# EAGLE design DosTres_v3 (EAGLE 6.2)
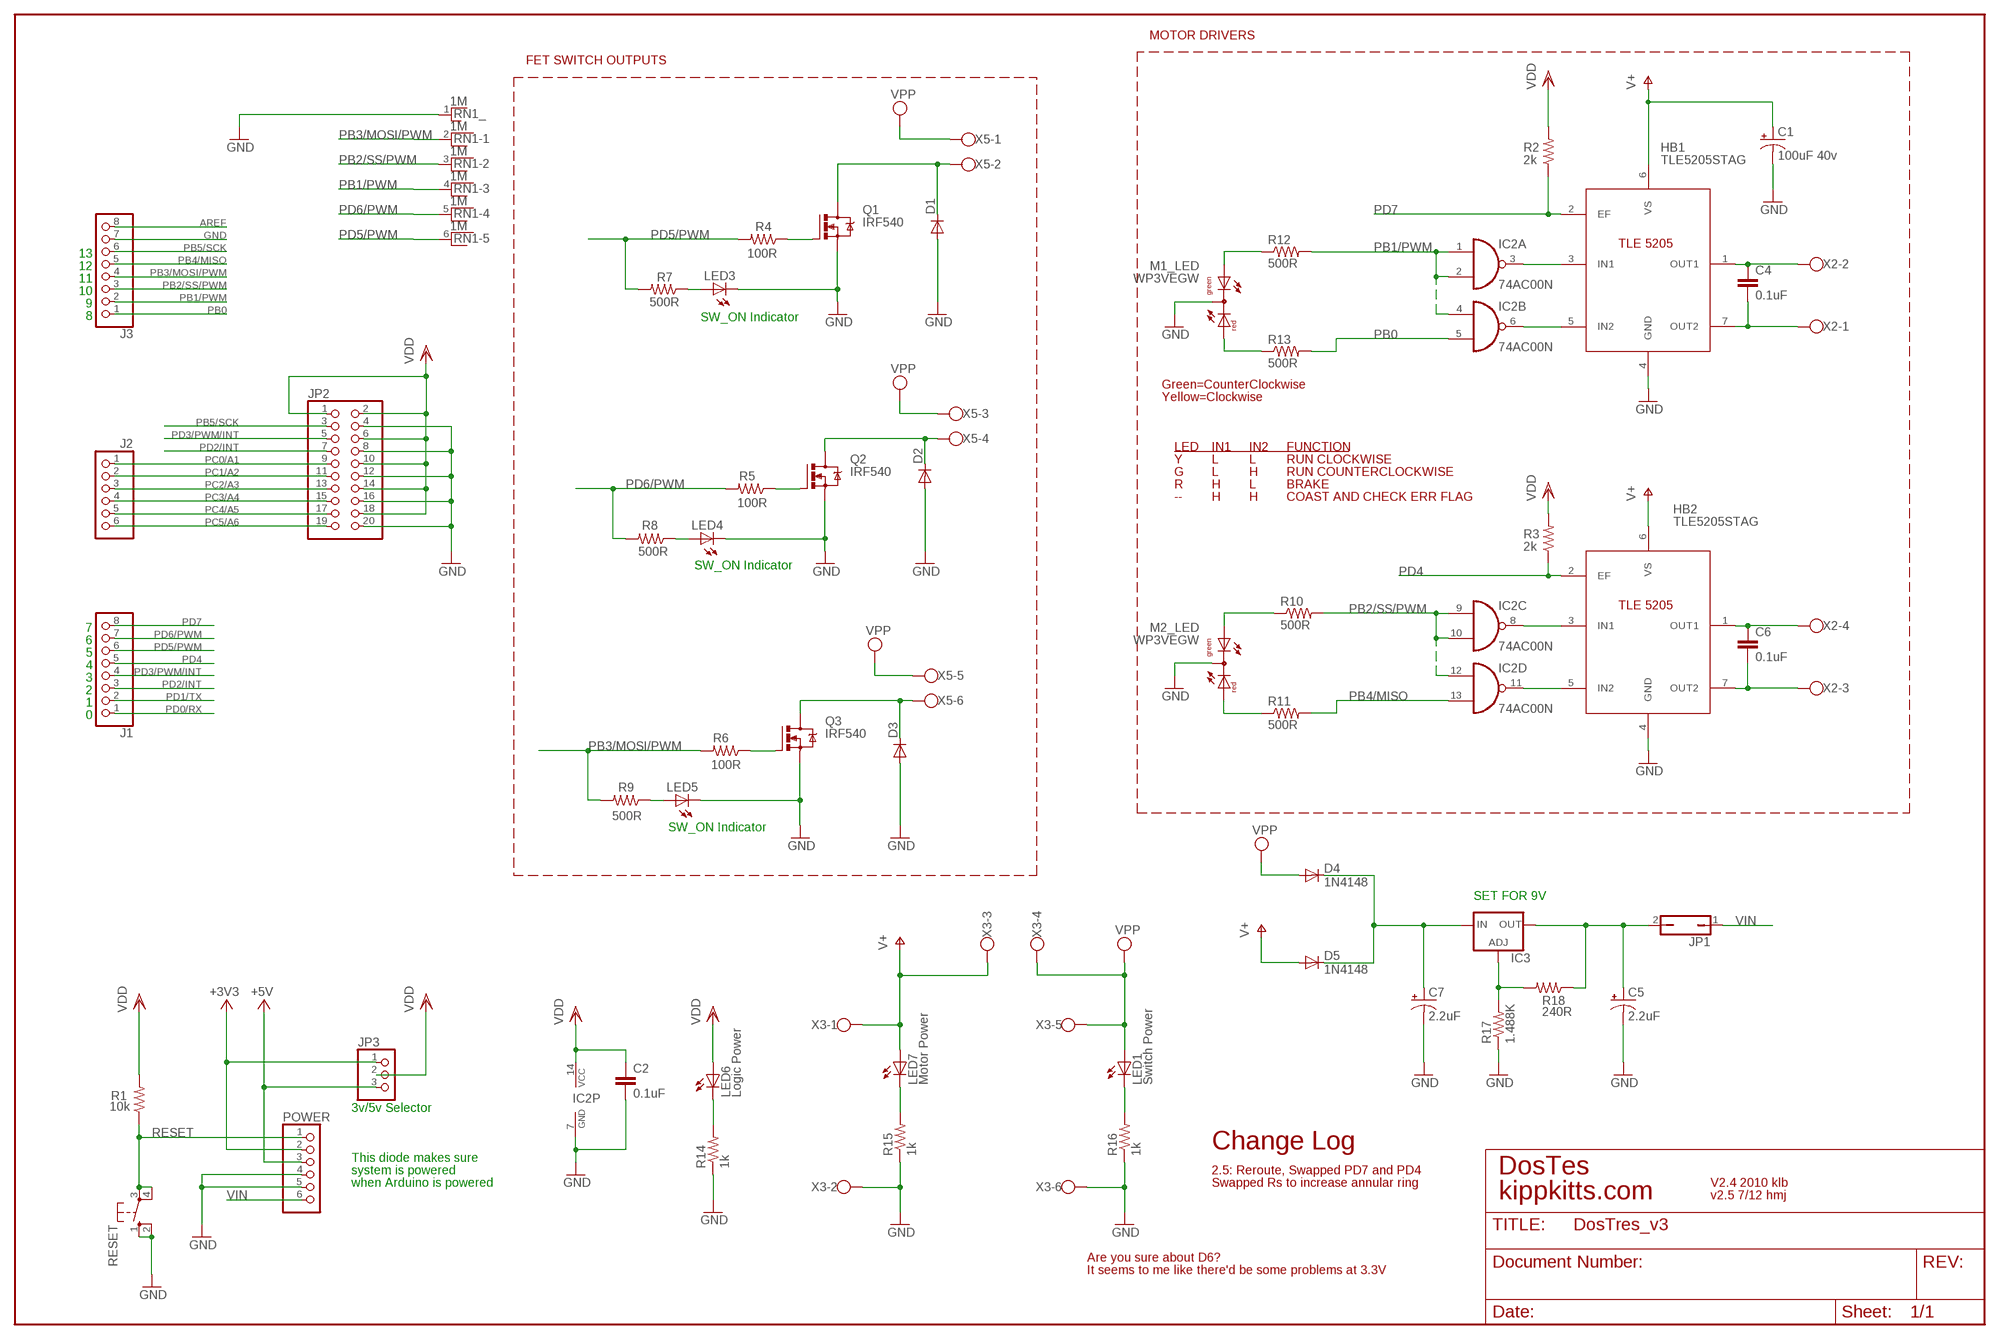
[diagram p0: schematic, sheet 1]

## Parts
C1  100uF 40v  CPOL-USE2,5-6E  [E2,5-6E]
C2  0.1uF  CAPKIT  [CAP-PTH-SMALL-KIT]
C4  0.1uF  CAPKIT  [CAP-PTH-SMALL-KIT]
C5  2.2uF  CAP_POLPTH2  [CPOL-RADIAL-10UF-25V]
C6  0.1uF  CAPKIT  [CAP-PTH-SMALL-KIT]
C7  2.2uF  CAP_POLPTH2  [CPOL-RADIAL-10UF-25V]
D1  DIODE-1MMHOLED-7.5BH  [D-7.5BH]
D2  DIODE-1MMHOLED-7.5BH  [D-7.5BH]
D3  DIODE-1MMHOLED-7.5BH  [D-7.5BH]
D4  1N4148  DIODE-1MMHOLED-7.5BH  [D-7.5BH]
D5  1N4148  DIODE-1MMHOLED-7.5BH  [D-7.5BH]
HB1  TLE5205STAG  [TO220-7-11]
HB2  TLE5205STAG  [TO220-7-11]
IC2  74AC00N  [DIL14]
IC3  LM317TS  [317TS]
J1  PINHD-1X8  [1X08]
J2  PINHD-1X6  [1X06]
J3  PINHD-1X8  [1X08]
JP1  JP1Q  [JP1]
JP2  PINHD-2X10HAND  [2X10HAND]
JP3  PINHD-1X3  [1X03]
LED1  Switch Power  LED3MMX1MM3MM  [LED3MM]
LED3  LED3MMX1MM3MM  [LED3MM]
LED4  LED3MMX1MM3MM  [LED3MM]
LED5  LED3MMX1MM3MM  [LED3MM]
LED6  Logic Power  LED3MMX1MM3MM  [LED3MM]
LED7  Motor Power  LED3MMX1MM3MM  [LED3MM]
M1_LED  WP3VEGW  [DUOLED-A-3MM]
M2_LED  WP3VEGW  [DUOLED-A-3MM]
POWER  PINHD-1X6  [1X06]
Q1  IRF540  [TO220BV]
Q2  IRF540  [TO220BV]
Q3  IRF540  [TO220BV]
R1  10k  R-US_0207/2V  [0207/2V]
R2  2k  R-US_0207/2V  [0207/2V]
R3  2k  R-US_0207/2V  [0207/2V]
R4  100R  R-US_0207/2V  [0207/2V]
R5  100R  R-US_0207/2V  [0207/2V]
R6  100R  R-US_0207/2V  [0207/2V]
R7  500R  R-US_0207/2V  [0207/2V]
R8  500R  R-US_0207/2V  [0207/2V]
R9  500R  R-US_0207/2V  [0207/2V]
R10  500R  R-US_0207/2V  [0207/2V]
R11  500R  R-US_0207/2V  [0207/2V]
R12  500R  R-US_0207/2V  [0207/2V]
R13  500R  R-US_0207/2V  [0207/2V]
R14  1k  R-US_0207/2V  [0207/2V]
R15  1k  R-US_0207/2V  [0207/2V]
R16  1k  R-US_0207/2V  [0207/2V]
R17  1.488K  R-US_0207/2V  [0207/2V]
R18  240R  R-US_0207/2V  [0207/2V]
RESET  10-XX  [B3F-10XX]
RN1  1M  RNX5  [RN-6]
X2  W237-4  [W237-4]
X3  W237-6  [W237-6]
X5  W237-6  [W237-6]

## Nets
+3V3: JP3.1 POWER.2
+5V [usbvcc]: JP3.3 POWER.3
AREF [aref]: J3.8
GND [gnd]: C1.- C2.2 C5.2(-) C7.2(-) D1.A D2.A D3.A HB1.4(GND) HB2.4(GND) IC2.7(P:GND) J3.7 JP2.4 JP2.8 JP2.12 JP2.16 JP2.20 LED3.K(C) LED4.K(C) LED5.K(C) M1_LED.2(C) M2_LED.2(C) POWER.4 POWER.5 Q1.S Q2.S Q3.S R14.1 R15.1 R16.1 R17.1 RESET.1(S) RESET.2(S1) RN1.1 X3.2 X3.6
M1.1: C4.1 HB1.1(OUT1) X2.2
M1.2: C4.2 HB1.7(OUT2) X2.1
M2.1: C6.1 HB2.1(OUT1) X2.4
M2.2: C6.2 HB2.7(OUT2) X2.3
N$1: Q1.G R4.1
N$2: Q2.G R5.1
N$3: Q3.G R6.1
N$4: M1_LED.3(AG) R12.1
N$5: HB1.3(IN1) IC2.3(A:O)
N$6: HB1.5(IN2) IC2.6(B:O)
N$7: HB2.3(IN1) IC2.8(C:O)
N$8: HB2.5(IN2) IC2.11(D:O)
N$9: M1_LED.1(AR) R13.1
N$10 [power]: D3.C Q3.D X5.6
N$11 [power]: D2.C Q2.D X5.4
N$12: M2_LED.1(AR) R11.1
N$13: M2_LED.3(AG) R10.1
N$14 [power]: D1.C Q1.D X5.2
N$15: C7.1(+) D4.C D5.C IC3.3(IN)
N$16: LED3.A R7.1
N$17: LED4.A R8.1
N$18: LED5.A R9.1
N$19: C5.1(+) IC3.2(OUT) JP1.2 R18.1
N$20: IC3.1(ADJ) R17.2 R18.2
N$22: LED6.K(C) R14.2
N$23: LED7.K(C) R15.2
N$24: LED1.K(C) R16.2
PB0: IC2.5(B:I1) J3.1 R13.2
PB1/PWM: IC2.1(A:I0) IC2.2(A:I1) IC2.4(B:I0) J3.2 R12.2 RN1.4
PB2/SS/PWM: IC2.9(C:I0) IC2.10(C:I1) IC2.12(D:I0) J3.3 R10.2 RN1.3
PB3/MOSI/PWM: J3.4 R6.2 R9.2 RN1.2
PB4/MISO: IC2.13(D:I1) J3.5 R11.2
PB5/SCK: J3.6 JP2.3
PC0/A1: J2.1 JP2.9
PC1/A2: J2.2 JP2.11
PC2/A3: J2.3 JP2.13
PC3/A4: J2.4 JP2.15
PC4/A5: J2.5 JP2.17
PC5/A6: J2.6 JP2.19
PD0/RX: J1.1
PD1/TX: J1.2
PD2/INT: J1.3 JP2.7
PD3/PWM/INT: J1.4 JP2.5
PD4: HB2.2(EF) J1.5 R3.1
PD5/PWM: J1.6 R4.2 R7.2 RN1.6
PD6/PWM: J1.7 R5.2 R8.2 RN1.5
PD7: HB1.2(EF) J1.8 R2.1
RESET: POWER.1 R1.1 RESET.3(P) RESET.4(P1)
V+ [power]: C1.+ D5.A HB1.6(VS) HB2.6(VS) LED7.A X3.1 X3.3
VDD [usbvcc]: C2.1 IC2.14(P:VCC) JP2.1 JP2.2 JP2.6 JP2.10 JP2.14 JP2.18 JP3.2 LED6.A R1.2 R2.2 R3.2
VIN [power]: JP1.1 POWER.6
VPP [power]: D4.A LED1.A X3.4 X3.5 X5.1 X5.3 X5.5

## Notes on the sheet
- MOTOR DRIVERS
- FET SWITCH OUTPUTS
- 13
- 12
- 11
- 10
- 9
- 8 | SW_ON Indicator
- Green=CounterClockwise
- Yellow=Clockwise
- LED | IN1 | IN2 | FUNCTION
- Y | L | L | RUN CLOCKWISE
- G | L | H | RUN COUNTERCLOCKWISE
- R | H | L | BRAKE
- -- | H | H | COAST AND CHECK ERR FLAG
- SW_ON Indicator
- 7
- 6
- 5
- 4
- 3
- 2
- 1
- 0
- SW_ON Indicator
- SET FOR 9V
- 3v/5v Selector
- Change Log
- This diode makes sure
- system is powered | 2.5: Reroute, Swapped PD7 and PD4 | DosTes
- when Arduino is powered | Swapped Rs to increase annular ring | V2.4 2010 klb
- kippkitts.com | v2.5 7/12 hmj
- Are you sure about D6?
- It seems to me like there'd be some problems at 3.3V

## Library data of the parts
C1 = resistor:CPOL-US: POLARIZED CAPACITOR, American symbol
C2 C4 C6 = SparkFun:CAP: Capacitor Standard 0603 ceramic capacitor, and 0.1" leaded capacitor.
C5 C7 = KippKitts:CAP_POL: Capacitor Polarized These are standard SMD and PTH capacitors. Normally 10uF, 47uF, and 100uF in electrolytic and tantalum varieties. Always verify the external diameter of the through hole cap, it varies with capacity, voltage, and manufacturer. The EIA devices should be standard.
D1-D5 = KippKits:DIODE-1MMHOLE: DIODE
HB1 HB2 = infineon_tle_power:TLE5205
IC2 = 74xx-eu:74*00: Quad 2-input NAND gate
IC3 = v-reg:LM317TS: VOLTAGE REGULATOR
J1 J3 = pinhead:PINHD-1X8: PIN HEADER
J2 POWER = pinhead:PINHD-1X6: PIN HEADER
JP1 = jumper:JP1Q: JUMPER
JP2 = KippKits:PINHD-2X10: PIN HEADER
JP3 = pinhead:PINHD-1X3: PIN HEADER
LED1 LED3-LED7 = KippKits:LED3MMX1MM: LED with 1mm holes;
M1_LED M2_LED = KippKits:WP3VEGW
Q1-Q3 = transistor-power:IRF540: HEXFET Power MOSFET
R1-R18 = adafruit:R-US_: RESISTOR, American symbol
RESET = switch-omron:10-XX: OMRON SWITCH; MPN: B3F-1000; OC_FARNELL: 176432; OC_NEWARK: 36M3542
RN1 = resistor-net:RNX5: RESISTOR NETWORK; OC_FARNELL: unknown; OC_NEWARK: unknown
X2 = con-wago-500:W237-4: WAGO SCREW CLAMP; OC_FARNELL: unknown; OC_NEWARK: unknown
X3 X5 = con-wago-500:W237-6: WAGO SCREW CLAMP; OC_FARNELL: unknown; OC_NEWARK: unknown

## Net classes
0 default: width 0.152 mm, drill 0.305 mm, clearance 0.152 mm
1 power: width 0.203 mm, drill 0.305 mm, clearance 0.203 mm
2 gnd: width 0.203 mm, drill 0.305 mm, clearance 0.152 mm
3 usbvcc: width 0.203 mm, drill 0.305 mm, clearance 0.152 mm
4 aref: width 0.203 mm

## Board
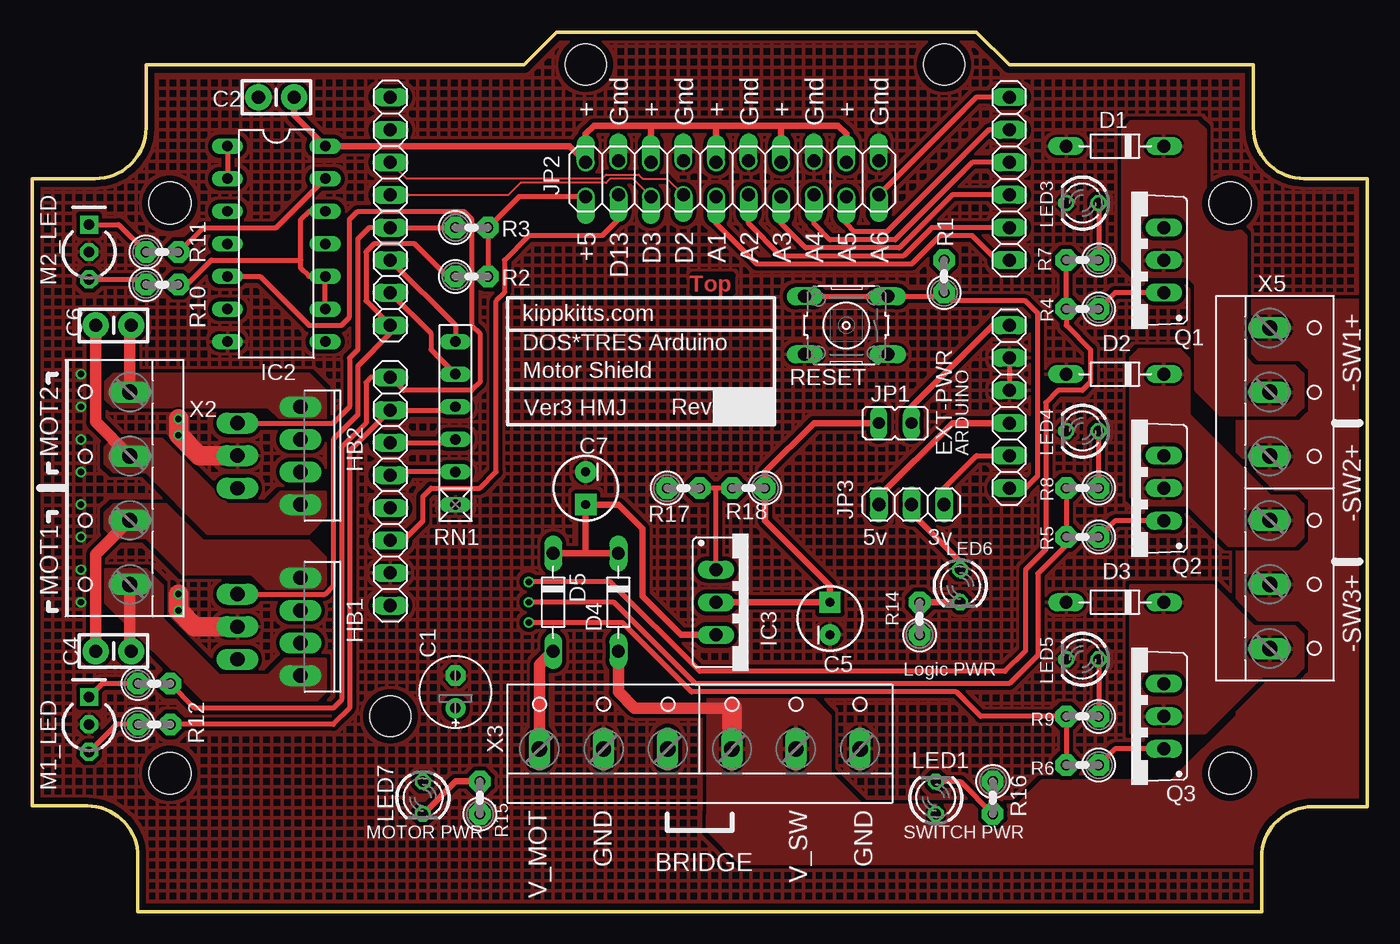
[diagram p1: board, top side]
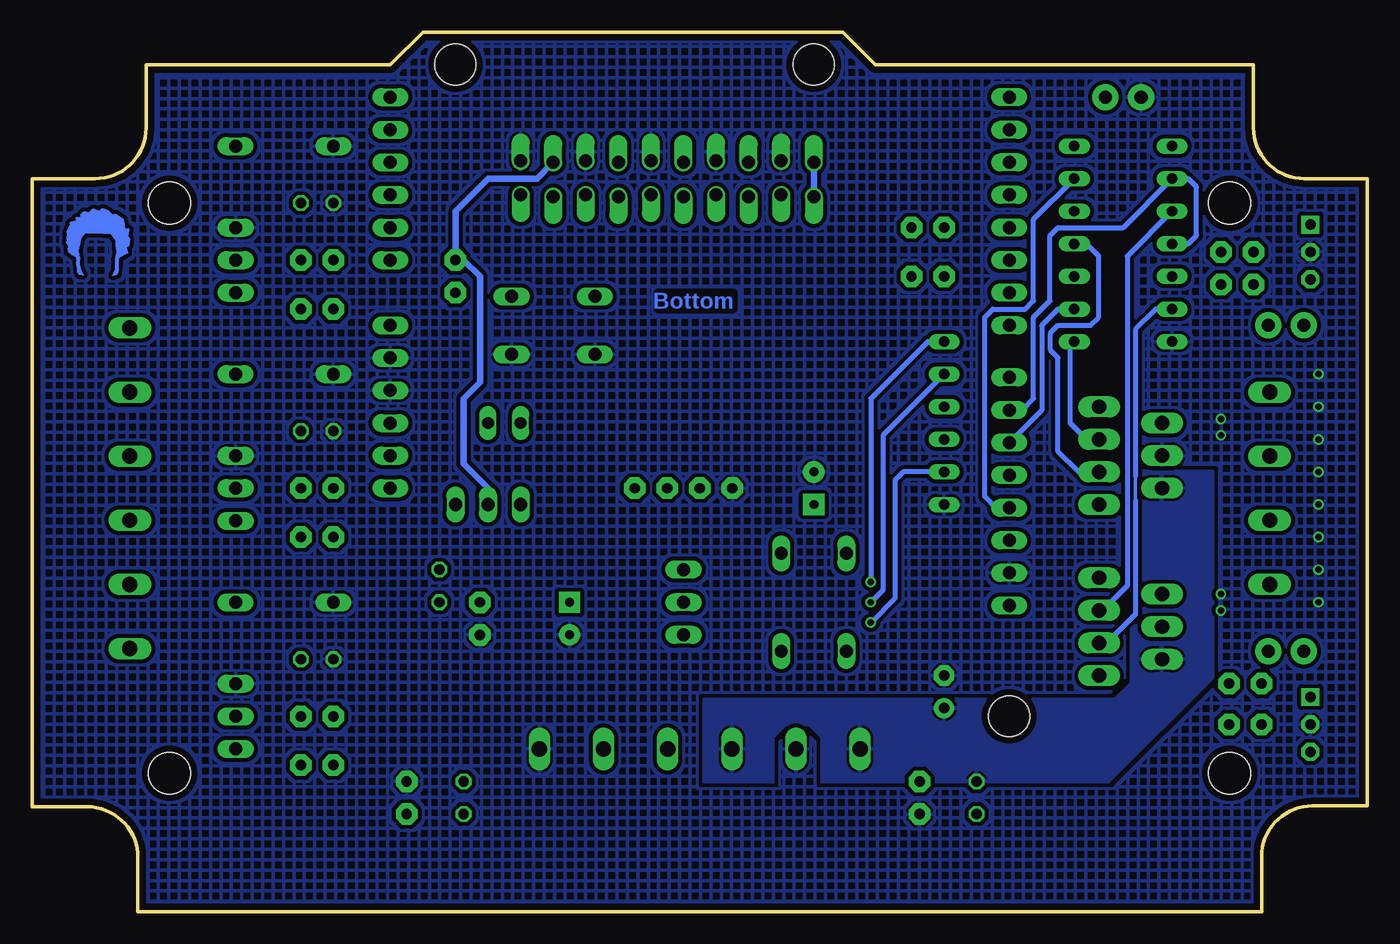
[diagram p2: board, bottom side, seen from below]

Size 104.14 x 68.58 mm. Coordinates in mm from the lower left corner, seen from the top.
Outline: 38.35,66.04 40.89,68.58 73.66,68.58 76.2,66.04 95.25,66.04 95.25,61.11 arc90 99.21,57.15 104.14,57.15 104.14,8.19 99.85,8.19 arc90 95.89,4.22 95.89,0 8.26,0 8.26,4.29 arc90 4.29,8.26 0,8.26 0,57.15 4.93,57.15 arc90 8.89,61.11 8.89,66.04 38.35,66.04
Copper layers (1*16): Top 0.035mm / dielectric 1.5mm / Bottom 0.035mm
Design rules: minimum track width 6mil, minimum drill 12mil, track to track 6mil, track to pad 6mil, pad to pad 6mil, via to via 6mil, smd to smd 6mil, copper to edge 20mil, drill to drill 8mil, minimum pad ring 8mil, minimum via ring 6mil, stop-mask expansion 3mil, vias tented up to drill 0mil, thermal gap 8mil
Holes 3.2 mm at 43.18,66.04 71.12,66.04 27.94,15.24
Holes 3.28 mm at 10.74,10.79 10.74,55.24 93.42,55.24 93.42,10.79

### Footprints (pad centres in the part's own frame; a part is rotated, then mirrored left to right if it is on the bottom)
E2,5-6E = drill 0.813 pad 1.575: + -1.27,0 | drill 0.813 pad 1.575 octagon: - 1.27,0
CAP-PTH-SMALL-KIT = drill 1.016 pad 2.032: 1 -1.397,0; 2 1.397,0
CPOL-RADIAL-10UF-25V = drill 0.7 pad 1.651 square: 1 1.27,0 | drill 0.7 pad 1.651: 2 -1.27,0
D-7.5BH = drill 1 long: A 3.81,0; C -3.81,0
TO220-7-11 = drill 1.118 pad 1.626 long: 1 -3.81,-3.126; 2 -2.54,-8.036; 3 -1.27,-3.126; 4 0,-8.036; 5 1.27,-3.126; 6 2.54,-8.036; 7 3.81,-3.126
DIL14 = drill 0.813 long: 1 -7.62,-3.81; 2 -5.08,-3.81; 3 -2.54,-3.81; 4 0,-3.81; 5 2.54,-3.81; 6 5.08,-3.81; 7 7.62,-3.81; 8 7.62,3.81; 9 5.08,3.81; 10 2.54,3.81; 11 0,3.81; 12 -2.54,3.81; 13 -5.08,3.81; 14 -7.62,3.81
317TS = drill 1.016 long: 1 -2.54,-2.54; 2 0,-2.54; 3 2.54,-2.54
1X08 = drill 1.016 long: 1 -8.89,0; 2 -6.35,0; 3 -3.81,0; 4 -1.27,0; 5 1.27,0; 6 3.81,0; 7 6.35,0; 8 8.89,0
1X06 = drill 1.016 long: 1 -6.35,0; 2 -3.81,0; 3 -1.27,0; 4 1.27,0; 5 3.81,0; 6 6.35,0
JP1 = drill 0.914 long: 1 0,-1.27; 2 0,1.27
2X10HAND = drill 1.016 offset: 1 -11.43,-1.397; 2 -11.43,1.27; 3 -8.89,-1.27; 4 -8.89,1.397; 5 -6.35,-1.397; 6 -6.35,1.27; 7 -3.81,-1.27; 8 -3.81,1.397; 9 -1.27,-1.397; 10 -1.27,1.27; 11 1.27,-1.27; 12 1.27,1.397; 13 3.81,-1.397; 14 3.81,1.27; 15 6.35,-1.27; 16 6.35,1.397; 17 8.89,-1.397; 18 8.89,1.27; 19 11.43,-1.27; 20 11.43,1.397
1X03 = drill 1.016 long: 1 -2.54,0; 2 0,0; 3 2.54,0
LED3MM = drill 0.813 octagon: A -1.27,0; K 1.27,0
DUOLED-A-3MM = drill 0.8 pad 1.4 square: 1 -2.14,0 | drill 0.8 pad 1.4 octagon: 2 0,0; 3 2.14,0
TO220BV = drill 1.016 long: D 0,-2.54; G -2.54,-2.54; S 2.54,-2.54
0207/2V = drill 0.813 pad 1.676 octagon: 1 -1.27,0; 2 1.27,0
B3F-10XX = drill 1.016 long: 1 -3.251,2.261; 2 3.251,2.261; 3 -3.251,-2.261; 4 3.251,-2.261
RN-6 = drill 0.813 long: 1 -6.35,0; 2 -3.81,0; 3 -1.27,0; 4 1.27,0; 5 3.81,0; 6 6.35,0
W237-4 = drill 1.194 long: 1 -7.5,-1.27; 2 -2.5,-1.27; 3 2.5,-1.27; 4 7.5,-1.27
W237-6 = drill 1.194 long: 1 -12.5,-1.27; 2 -7.5,-1.27; 3 -2.5,-1.27; 4 2.5,-1.27; 5 7.5,-1.27; 6 12.5,-1.27

### Placement (x,y rotation side)
C1  33.02,17.14 90 top
C2  19.05,63.5 180 top
C4  6.35,20.32 0 top
C5  62.23,22.86 90 top
C6  6.35,45.72 180 top
C7  43.18,33.02 270 top
D1  84.45,59.69 180 top
D2  84.45,41.91 180 top
D3  84.45,24.13 180 top
D4  45.72,24.13 270 top
D5  40.64,24.13 270 top
HB1  24.05,22.23 270 top
HB2  24.05,35.56 270 top
IC2  19.05,52.07 270 top
IC3  55.88,24.13 270 top
J1  27.94,54.61 270 top
J2  76.2,57.15 90 top
J3  27.94,32.77 270 top
JP1  67.31,38.1 90 top
JP2  54.61,57.15 0 top
JP3  68.58,31.75 180 top
LED1  70.48,8.89 90 top
LED3  81.92,55.24 180 top
LED4  81.92,37.47 180 top
LED5  81.92,19.68 180 top
LED6  72.39,25.4 270 top
LED7  30.48,8.89 270 top
M1_LED  4.45,14.61 270 top
M2_LED  4.45,51.44 270 top
POWER  76.2,39.37 90 top
Q1  85.72,50.8 90 top
Q2  85.72,33.02 90 top
Q3  85.72,15.24 90 top
R1  71.12,49.53 90 top
R2  34.29,49.53 0 top
R3  34.29,53.34 0 top
R4  81.92,46.99 180 top
R5  81.92,29.21 180 top
R6  81.92,11.43 180 top
R7  81.92,50.8 180 top
R8  81.92,33.02 180 top
R9  81.92,15.24 180 top
R10  10.16,48.9 0 top
R11  10.16,51.44 0 top
R12  9.53,14.61 0 top
R13  9.53,17.78 0 top
R14  69.22,22.86 90 top
R15  34.92,8.89 90 top
R16  74.93,8.89 270 top
R17  50.8,33.02 0 top
R18  55.88,33.02 180 top
RESET  63.5,45.72 180 top
RN1  33.02,38.1 90 top
U$1  [TOP_DOCU_5MM]  95.89,48.9 0 top
U$3  [COPPER_5MM]  102.23,48.9 0 bottom
X2  6.35,33.02 90 top
X3  52.07,13.97 0 top
X5  97.79,33.02 270 top

### Tracks (layer width: path | path; a pad name or v marks a point on that pad's centre or on a via)
+3V3
  Top 0.406: JP3.1 71.12,33.02 73.66,35.56 POWER.2
+5V
  Top 0.508: JP3.3 66.04,32.38 71.75,38.1 POWER.3
GND  (via drill 0.5)
  Top 0.406: POWER.5 POWER.4
  Top 1.524: HB1.4 12.7,22.23 v11.43,23.5 v11.43,24.77 | HB2.4 13.05,35.56 11.43,37.18 v11.43,38.42
  other vias: 11.43,37.15 3.81,41.91 3.81,39.37 3.81,36.83 3.81,34.29 3.81,31.75 3.81,24.13 3.81,26.67 3.81,29.21
  pour Bottom (isolate 0.305, rank 2, hatched): -1.27,-1.27 104.78,-1.27 105.41,69.85 -1.27,69.85
  pour Top (isolate 0.305, rank 3, hatched): -3.81,69.85 -3.81,71.12 106.68,71.12 106.68,-3.17 -3.81,-3.17
M1.1
  Top 0.889: C4.1 4.95,27.85 X2.2
  pour Top (no thermals): 22.86,25.08 18.41,25.08 17.14,26.35 11.75,26.35 8.89,29.21 6.35,29.21 5.71,29.84 5.71,31.11 6.35,31.75 10.48,31.75 13.34,28.89 21.59,28.89 22.86,27.62
M1.2
  Top 0.889: C4.2 7.62,20.45 X2.1
  pour Top (no thermals): 22.86,19.68 22.86,17.14 22.23,16.51 13.34,16.51 5.71,24.13 5.71,26.67 8.89,26.67 10.16,25.4 10.16,22.86 14.61,18.41 18.41,18.41 19.37,19.37 19.68,19.68
M2.1
  Top 0.889: C6.1 7.62,45.59 X2.4
  pour Top (no thermals): 22.86,38.42 19.37,38.42 18.41,39.37 6.35,39.37 5.71,40.01 5.71,41.27 6.35,41.91 21.59,41.91 22.86,40.64
M2.2
  Top 0.889: X2.3 4.95,38.19 C6.2
  pour Top (no thermals): 22.86,32.7 22.86,30.8 21.59,29.53 13.65,29.53 8.89,34.29 6.35,34.29 5.71,34.92 5.71,36.2 6.35,36.83 10.16,36.83 15.24,31.75 18.41,31.75 19.37,32.7
N$1
  Top 0.406: Q1.G 84.45,48.26 R4.1
N$2
  Top 0.406: Q2.G 84.45,30.48 R5.1
N$3
  Top 0.406: Q3.G 84.45,12.7 R6.1
N$4
  Top 0.406: R12.1 6.58,14.61 M1_LED.3
N$5
  Bottom 0.406: IC2.3 18.73,51.12 18.73,25.4 20.64,23.5 HB1.3
N$6
  Bottom 0.254: 18.1,33.97 18.1,32.07
  Bottom 0.406: IC2.6 16.51,46.99 18.1,45.4 18.1,33.97 | 18.1,32.07 18.1,23.18 20.32,20.95 HB1.5
N$7
  Bottom 0.406: HB2.3 21.91,36.83 23.18,38.1 23.18,44.13 IC2.8
N$8
  Bottom 0.406: HB2.5 22.54,34.29 24.13,35.88 24.13,43.18 24.77,43.81 24.77,45.09 24.13,45.72 21.59,45.72 20.95,46.35 20.95,51.12 21.91,52.07 IC2.11
N$9
  Top 0.406: R13.1 5.48,17.78 M1_LED.1
N$10
  pour Top (isolate 0.305): 95.25,22.23 98.42,22.23 99.06,21.59 99.06,19.05 98.42,18.41 95.89,18.41 91.44,13.97 85.72,13.97 85.72,25.4 92.08,25.4
N$11
  pour Top (isolate 0.305): 86.36,43.81 89.46,43.81 90.17,43.11 90.17,38.73 96.52,32.38 98.42,32.38 99.06,31.75 99.06,29.21 98.42,28.57 93.34,28.57 90.17,31.75 86.36,31.75 85.72,32.38 85.72,43.18
N$12
  Top 0.406: M2_LED.1 6.75,53.58 R11.1
N$13
  Top 0.406: M2_LED.3 8.49,49.3 R10.1
N$14
  pour Top (isolate 0.305): 95.25,42.55 98.42,42.55 99.06,41.91 99.06,39.37 98.42,38.73 92.71,38.73 90.81,40.64 90.81,48.9 90.17,49.53 86.36,49.53 85.72,50.16 85.09,50.8 85.09,60.96 85.72,61.59 90.81,61.59 91.44,60.96 91.44,53.98 92.08,53.34 93.98,53.34 94.61,52.7 94.61,43.18
N$15
  Top 0.508: D5.C 43.18,27.94 | IC3.3 50.62,21.59 47.62,24.59 47.62,29.84 45.72,31.75 C7.1 43.18,27.94 | D4.C 43.18,27.94
N$16
  Top 0.406: LED3.A R7.1
N$17
  Top 0.406: R8.1 LED4.A
N$18
  Top 0.406: LED5.A R9.1
N$19
  Top 0.508: JP1.2 60.96,38.1 57.15,34.29 R18.1 57.15,30.48 62.23,25.4 C5.1 IC3.2
N$20
  Top 0.406: IC3.1 53.34,33.02 | 53.34,33.02 R17.2 | R18.2 53.34,33.02
N$22
  Top 0.508: R14.2 LED6.K
N$23
  Top 0.508: R15.2 33.02,10.16 LED7.K
N$24
  Top 0.406: LED1.K 72.39,10.16 R16.2
PB0
  Top 0.406: R13.2 12.7,15.88 23.5,15.88 24.13,16.51 24.13,36.2 26.04,38.1 26.04,41.27 26.42,41.66 J3.1 28.96,40.64 34.29,40.64 34.92,41.27 34.92,45.09 34.29,45.72 34.29,53.98 33.66,54.61 25.4,54.61 24.77,53.98 24.77,46.35 24.13,45.72 21.59,45.72 17.78,49.53 IC2.5
PB1/PWM
  Top 0.406: RN1.4 32.77,39.12 J3.2 24.77,35.94 24.77,15.88 23.5,14.61 R12.2 | IC2.1 IC2.2
  Bottom 0.406: J3.2 26.92,39.12 26.04,40.01 26.04,46.35 24.77,47.62 24.77,52.7 24.13,53.34 19.05,53.34 IC2.2 13.97,57.15 13.34,56.52 13.34,52.7 13.97,52.07 IC2.4
PB2/SS/PWM
  Top 0.406: J3.3 32.77,36.58 RN1.3 | IC2.9 IC2.10 21.59,49.53 20.95,50.16 20.95,50.8 | R10.2 12.06,48.9 13.97,50.8 20.95,50.8 | IC2.12 21.59,54.61 20.95,53.98 20.95,50.8
  Bottom 0.406: IC2.9 24.13,46.99 25.4,45.72 25.4,39.12 J3.3
PB3/MOSI/PWM  (via drill 0.5)
  Top 0.406: R6.2 R9.2 73.98,15.24 72.07,17.14 51.44,17.14 46.04,22.54 v38.73,22.54 | RN1.2 28.19,34.29 J3.4
  Bottom 0.406: RN1.2 36.2,34.29 36.83,33.66 36.83,24.45 v38.73,22.54
PB4/MISO
  Top 0.406: R11.2 13.34,53.34 19.05,53.34 IC2.13
  Bottom 0.406: J3.5 28.96,31.5 29.84,32.38 29.84,46.35 29.21,46.99 26.67,46.99 26.04,47.62 26.04,53.98 IC2.13
PB5/SCK
  Top 0.406: J3.6 28.96,28.96 30.48,30.48 30.48,32.38 31.11,33.02 34.92,33.02 36.2,34.29 36.2,47.62 36.83,48.26 36.83,50.8 38.73,52.7 44.45,52.7 45.72,53.98 JP2.3
PC0/A1
  Top 0.406: J2.1 75.25,50.8 73.34,52.7 70.8,52.7 68.58,50.48 56.52,50.48 53.34,53.66 JP2.9
PC1/A2
  Top 0.406: J2.2 70.17,53.34 67.94,51.12 58.42,51.12 55.88,53.66 JP2.11
PC2/A3
  Top 0.406: J2.3 71.75,55.88 67.63,51.75 60.33,51.75 58.42,53.66 JP2.13
PC3/A4
  Top 0.406: J2.4 73.34,58.42 67.31,52.39 62.23,52.39 60.96,53.66 JP2.15
PC4/A5
  Top 0.406: J2.5 74.61,60.96 66.67,53.02 64.14,53.02 63.5,53.66 JP2.17
PC5/A6
  Top 0.406: J2.6 73.66,63.5 JP2.19
PD2/INT
  Top 0.152: JP2.7 49.53,57.15 47.62,57.15 47.31,57.47 44.77,57.47 44.45,57.15 29.21,57.15 J1.3
PD3/PWM/INT
  Top 0.152: J1.4 37.15,55.88 38.1,56.83 44.77,56.83 45.09,57.15 46.86,57.15 JP2.5
PD4
  Top 0.406: HB2.2 23.5,38.1 24.77,39.37 24.77,43.18 25.4,43.81 25.4,52.44 26.3,53.34 J1.5 R3.1
PD5/PWM  (via drill 0.5)
  Top 0.406: J1.6 33.02,45.72 RN1.6 | R7.2 R4.2 80.64,45.72 82.55,43.81 82.55,41.27 81.92,40.64 80.01,40.64 79.06,39.69 79.06,28.26 77.47,26.67 77.47,20.32 75.88,18.73 52.07,18.73 45.09,25.72 v38.73,25.72
  Bottom 0.406: RN1.6 34.29,44.45 38.73,40.01 v38.73,25.72
PD6/PWM  (via drill 0.5)
  Top 0.406: J1.7 31.11,45.09 31.11,43.81 RN1.5 | R5.2 R8.2 80.64,28.57 78.42,26.35 78.42,20 76.2,17.78 51.75,17.78 45.4,24.13 v38.73,24.13
  Bottom 0.406: RN1.5 37.78,37.15 37.78,25.08 v38.73,24.13
PD7
  Top 0.406: HB1.2 22.86,24.77 23.5,25.4 23.5,36.83 25.4,38.73 25.4,42.55 27.94,45.09 J1.8 26.04,47.62 26.04,51.44 26.67,52.07 29.84,52.07 32.38,49.53 R2.1
RESET
  Top 0.406: POWER.1 77.47,33.02 78.42,33.97 78.42,46.67 77.47,47.62 71.75,47.62 R1.1 70.84,47.98 RESET.3 RESET.4
V+
  Top 0.889: X3.1 39.57,19.25 D5.A
  pour Bottom (isolate 0.305): 51.75,16.51 51.75,10.16 46.35,10.16 46.35,13.65 45.4,14.61 43.5,14.61 42.55,13.65 42.55,10.16 20.2,10.16 12.06,18.29 12.06,34.29 18.41,34.29 18.41,17.78 19.68,16.51
VDD
  Top 0.406: R2.2 R3.2 37.97,55.75 JP2.1
  Top 0.508: JP3.2 68.58,31.11 72.39,27.3 LED6.A | 48.26,61.28 43.81,61.28 43.18,60.64 JP2.2 41.91,59.69 IC2.14 20.45,62.1 C2.1 | 48.26,61.28 53.34,61.28 | 53.34,61.28 58.42,61.28 | 58.42,61.28 62.87,61.28 63.5,60.64 JP2.18 | JP2.6 48.26,61.28 | JP2.10 53.34,61.28 | JP2.14 58.42,61.28
  Bottom 0.508: JP2.2 JP2.1 | JP2.18 64.77,57.15 68.58,57.15 71.12,54.61 R1.2 70.48,50.8 69.22,49.53 69.22,41.27 70.48,40.01 70.48,34.92 68.58,33.02 JP3.2
VIN
  Top 0.508: POWER.6 74.93,45.72 68.58,39.37 JP1.1
VPP
  Top 0.889: D4.A 45.72,17.14 46.99,15.88 54.53,15.88 54.57,15.91
  Top 1.524: X3.4 54.57,15.91
  pour Top (isolate 0.305, rank 2): 93.98,47.62 93.98,15.24 88.9,10.16 78.74,10.16 76.83,8.26 64.77,8.26 62.23,10.79 62.23,15.24 60.96,16.51 52.7,16.51 52.7,8.82 52.67,6.38 55.21,3.81 103.5,3.81 104.14,47.62

### Text on the board
Top: Top
Bottom: Bottom
tPlace: MOTOR PWR | SWITCH PWR
tNames: Gnd | Gnd | Gnd | Gnd | Gnd | + | + | + | + | + | +5 | D13 | D3 | D2 | A1 | A2 | A3 | A4 | A5 | A6 | -SW1+ | kippkitts.com | DOS*TRES Arduino | Motor Shield | MOT2 | Rev | Ver3 HMJ | EXT-PWR | ARDUINO | -SW2+ | MOT1 | 5v | 3v | -SW3+ | Logic PWR | V_MOT | GND | V_SW | GND | BRIDGE